# EAGLE board schematics (EAGLE 9.6.2), part 1 of 2
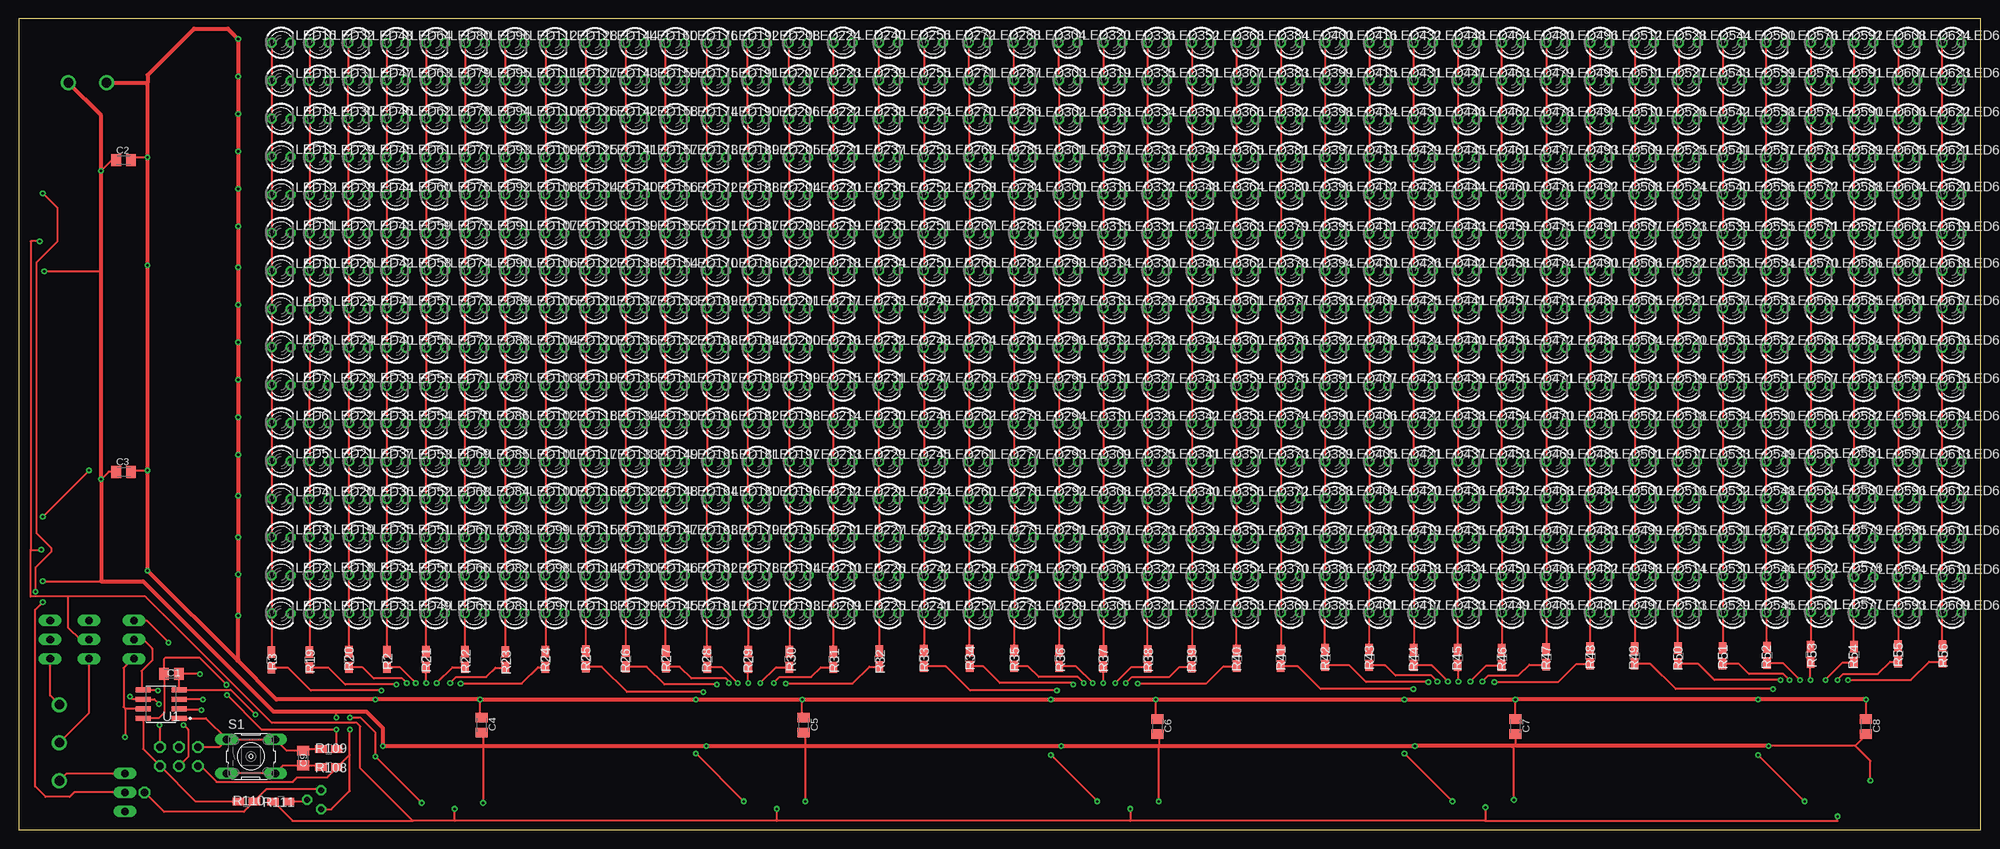
[diagram p2: board, top side]
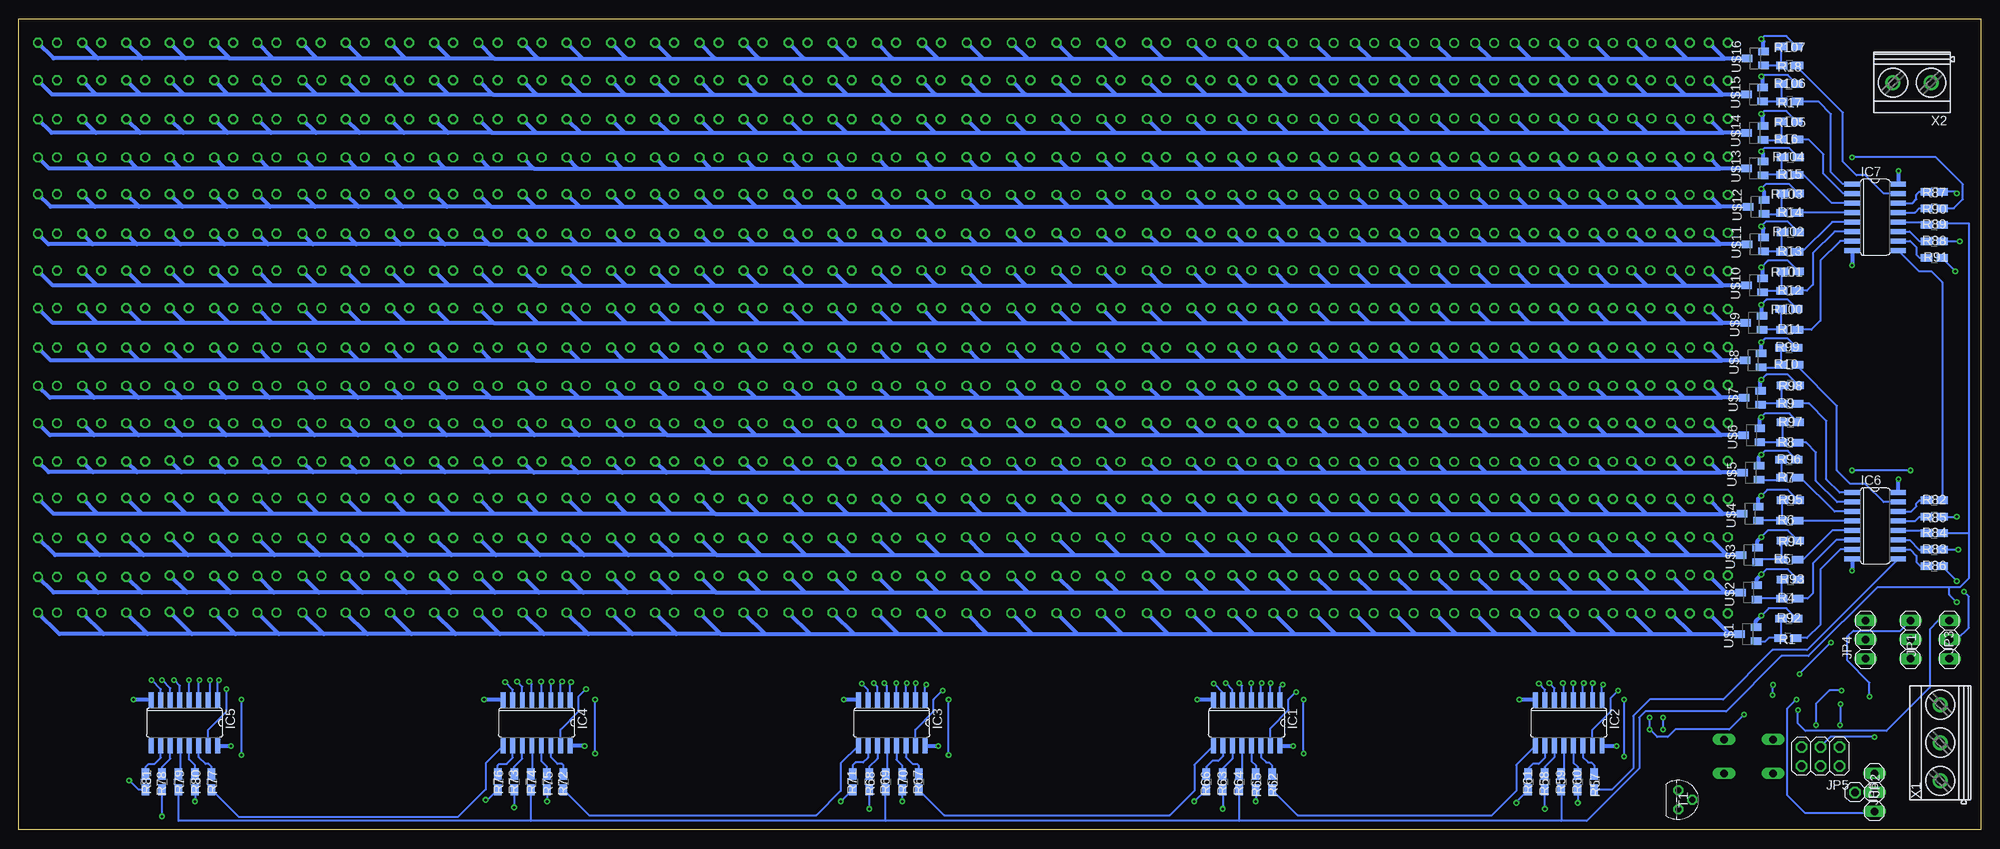
[diagram p3: board, bottom side, seen from below]

Size 261.94 x 108.32 mm. Coordinates in mm from the lower left corner, seen from the top.
Outline: 0,0 261.94,0 261.94,108.32 0,108.32 0,0
Copper layers (1*16): Top 0.035mm / dielectric 1.5mm / Bottom 0.035mm
Design rules "default": minimum track width 6mil, minimum drill 0.35mm, track to track 6mil, track to pad 6mil, pad to pad 6mil, via to via 6mil, smd to smd 6mil, copper to edge 40mil, drill to drill 6mil, minimum pad ring 10mil, minimum via ring 8mil, stop-mask expansion 4mil, vias tented up to drill 0mil, thermal gap 10mil

## Footprints (pad centres in the part's own frame; a part is rotated, then mirrored left to right if it is on the bottom)
C0805K = smd 1.3 x 1.6: 1 -1,0; 2 1,0
SO16 = smd 0.66 x 2.032: 1 -4.445,-3.073; 2 -3.175,-3.073; 3 -1.905,-3.073; 4 -0.635,-3.073; 5 0.635,-3.073; 6 1.905,-3.073; 7 3.175,-3.073; 8 4.445,-3.073; 9 4.445,3.073; 10 3.175,3.073; 11 1.905,3.073; 12 0.635,3.073; 13 -0.635,3.073; 14 -1.905,3.073; 15 -3.175,3.073; 16 -4.445,3.073
1X03 = drill 1.016 long: 1 -2.54,0; 2 0,0; 3 2.54,0
2X03 = drill 1.016 octagon: 1 -2.54,-1.27; 2 -2.54,1.27; 3 0,-1.27; 4 0,1.27; 5 2.54,-1.27; 6 2.54,1.27
1X01 = drill 1.016 octagon: 1 0,0
LED3MM = drill 0.813 octagon: A -1.27,0; K 1.27,0
R0805W = smd 1.5 x 1: 1 -1.052,0; 2 1.052,0
B3F-10XX = drill 1.016 long: 1 -3.251,2.261; 2 3.251,2.261; 3 -3.251,-2.261; 4 3.251,-2.261
TO92 = drill 0.813 octagon: 1 1.27,0; 2 0,1.905; 3 -1.27,0
SOIC-8 = smd 2 x 0.66: 1 -2.405,1.905; 2 -2.405,0.635; 3 -2.405,-0.635; 4 -2.405,-1.905; 5 2.405,-1.905; 6 2.405,-0.635; 7 2.405,0.635; 8 2.405,1.905
SOT23 = smd 1 x 1.4: 1 -0.95,-1.1; 2 0.95,-1.1; 3 0,1.1
MKDSN1,5/3-5,08 = drill 1.3 pad 2: 1 -7.641,0.025; 2 -2.561,0.025; 3 2.519,0.025
MKDSN1,5/2-5,08 = drill 1.3 pad 2: 1 -2.561,0.025; 2 2.519,0.025

## Placement (x,y rotation side)
C1  100n  [C0805K]  20.4,20.8 0 top
C2  100n  [C0805K]  14,89.4 0 top
C3  100n  [C0805K]  14,47.8 0 top
C4  100n  [C0805K]  61.8,14 270 top
C5  100n  [C0805K]  104.8,14 270 top
C6  100n  [C0805K]  152,13.8 270 top
C7  100n  [C0805K]  199.8,13.8 270 top
C8  100n  [C0805K]  246.6,13.8 270 top
C9  100n  [C0805K]  38,9.6 270 top
IC1  74HC595D  [SO16]  98,14.3 180 bottom
IC2  74HC595D  [SO16]  55,14.3 180 bottom
IC3  74HC595D  [SO16]  145.4,14.3 180 bottom
IC4  74HC595D  [SO16]  192.8,14.3 180 bottom
IC5  74HC595D  [SO16]  239.8,14.3 180 bottom
IC6  74HC595D  [SO16]  14.1,40.6 270 bottom
IC7  74HC595D  [SO16]  14.1,81.8 270 bottom
JP1  [1X03]  9.4,25.4 90 bottom
JP2  [1X03]  14.2,5 270 bottom
JP3  [1X03]  4.2,25.4 90 bottom
JP4  [1X03]  15.4,25.4 90 bottom
JP5  [2X03]  21.4,9.8 180 bottom
JP6  [1X01]  16.8,5 270 bottom
LED1  [LED3MM]  35.04,28.92 0 top
LED2  [LED3MM]  35.04,34 0 top
LED3  [LED3MM]  35.04,39.08 0 top
LED4  [LED3MM]  35.04,44.16 0 top
LED5  [LED3MM]  35.04,49.24 0 top
LED6  [LED3MM]  35.04,54.32 0 top
LED7  [LED3MM]  35.04,59.4 0 top
LED8  [LED3MM]  35.04,64.48 0 top
LED9  [LED3MM]  35.04,69.56 0 top
LED10  [LED3MM]  35.04,74.64 0 top
LED11  [LED3MM]  35.04,79.72 0 top
LED12  [LED3MM]  35.04,84.8 0 top
LED13  [LED3MM]  35.04,89.88 0 top
LED14  [LED3MM]  35.04,94.96 0 top
LED15  [LED3MM]  35.04,100.04 0 top
LED16  [LED3MM]  35.04,105.12 0 top
LED17  [LED3MM]  40.1,28.92 0 top
LED18  [LED3MM]  40.08,34.04 0 top
LED19  [LED3MM]  40.1,39.12 0 top
LED20  [LED3MM]  40.08,44.18 0 top
LED21  [LED3MM]  40.1,49.26 0 top
LED22  [LED3MM]  40.08,54.32 0 top
LED23  [LED3MM]  40.04,59.34 0 top
LED24  [LED3MM]  40.08,64.42 0 top
LED25  [LED3MM]  40.1,69.6 0 top
LED26  [LED3MM]  40.08,74.66 0 top
LED27  [LED3MM]  40.1,79.68 0 top
LED28  [LED3MM]  40.14,84.8 0 top
LED29  [LED3MM]  40.1,89.82 0 top
LED30  [LED3MM]  40.08,94.94 0 top
LED31  [LED3MM]  40.08,100.06 0 top
LED32  [LED3MM]  40.1,105.12 0 top
LED33  [LED3MM]  45.36,28.94 0 top
LED34  [LED3MM]  45.36,34.04 0 top
LED35  [LED3MM]  45.36,39.14 0 top
LED36  [LED3MM]  45.36,44.18 0 top
LED37  [LED3MM]  45.36,49.22 0 top
LED38  [LED3MM]  45.36,54.32 0 top
LED39  [LED3MM]  45.36,59.36 0 top
LED40  [LED3MM]  45.36,64.4 0 top
LED41  [LED3MM]  45.36,69.68 0 top
LED42  [LED3MM]  45.36,74.72 0 top
LED43  [LED3MM]  45.3,79.7 0 top
LED44  [LED3MM]  45.3,84.8 0 top
LED45  [LED3MM]  45.3,89.84 0 top
LED46  [LED3MM]  45.24,95 0 top
LED47  [LED3MM]  45.3,100.1 0 top
LED48  [LED3MM]  45.24,105.08 0 top
LED49  [LED3MM]  50.4,28.94 0 top
LED50  [LED3MM]  50.4,33.98 0 top
LED51  [LED3MM]  50.4,39.08 0 top
LED52  [LED3MM]  50.4,44.18 0 top
LED53  [LED3MM]  50.4,49.16 0 top
LED54  [LED3MM]  50.4,54.32 0 top
LED55  [LED3MM]  50.4,59.3 0 top
LED56  [LED3MM]  50.4,64.4 0 top
LED57  [LED3MM]  50.4,69.68 0 top
LED58  [LED3MM]  50.4,74.72 0 top
LED59  [LED3MM]  50.4,79.7 0 top
LED60  [LED3MM]  50.4,84.86 0 top
LED61  [LED3MM]  50.4,89.84 0 top
LED62  [LED3MM]  50.4,95 0 top
LED63  [LED3MM]  50.4,100.1 0 top
LED64  [LED3MM]  50.4,105.08 0 top
LED65  [LED3MM]  55.62,28.94 0 top
LED66  [LED3MM]  55.62,33.98 0 top
LED67  [LED3MM]  55.62,39.08 0 top
LED68  [LED3MM]  55.62,44.18 0 top
LED69  [LED3MM]  55.62,49.22 0 top
LED70  [LED3MM]  55.62,54.32 0 top
LED71  [LED3MM]  55.62,59.3 0 top
LED72  [LED3MM]  55.68,64.4 0 top
LED73  [LED3MM]  55.68,69.68 0 top
LED74  [LED3MM]  55.68,74.72 0 top
LED75  [LED3MM]  55.68,79.7 0 top
LED76  [LED3MM]  55.68,84.86 0 top
LED77  [LED3MM]  55.68,89.84 0 top
LED78  [LED3MM]  55.68,95 0 top
LED79  [LED3MM]  55.68,100.1 0 top
LED80  [LED3MM]  55.68,105.08 0 top
LED81  [LED3MM]  60.84,28.94 0 top
LED82  [LED3MM]  60.84,33.98 0 top
LED83  [LED3MM]  60.84,39.08 0 top
LED84  [LED3MM]  60.84,44.24 0 top
LED85  [LED3MM]  60.84,49.16 0 top
LED86  [LED3MM]  60.84,54.32 0 top
LED87  [LED3MM]  60.84,59.36 0 top
LED88  [LED3MM]  60.9,64.4 0 top
LED89  [LED3MM]  60.96,69.68 0 top
LED90  [LED3MM]  60.96,74.72 0 top
LED91  [LED3MM]  60.96,79.7 0 top
LED92  [LED3MM]  60.96,84.86 0 top
LED93  [LED3MM]  60.96,89.84 0 top
LED94  [LED3MM]  60.96,95 0 top
LED95  [LED3MM]  60.96,100.1 0 top
LED96  [LED3MM]  60.96,105.08 0 top
LED97  [LED3MM]  66.24,28.94 0 top
LED98  [LED3MM]  66.24,33.98 0 top
LED99  [LED3MM]  66.24,39.08 0 top
LED100  [LED3MM]  66.24,44.24 0 top
LED101  [LED3MM]  66.24,49.16 0 top
LED102  [LED3MM]  66.24,54.32 0 top
LED103  [LED3MM]  66.24,59.36 0 top
LED104  [LED3MM]  66.24,64.4 0 top
LED105  [LED3MM]  66.24,69.68 0 top
LED106  [LED3MM]  66.24,74.72 0 top
LED107  [LED3MM]  66.24,79.7 0 top
LED108  [LED3MM]  66.24,84.86 0 top
LED109  [LED3MM]  66.24,89.84 0 top
LED110  [LED3MM]  66.24,95 0 top
LED111  [LED3MM]  66.24,100.1 0 top
LED112  [LED3MM]  66.24,105.08 0 top
LED113  [LED3MM]  71.58,28.94 0 top
LED114  [LED3MM]  71.58,33.98 0 top
LED115  [LED3MM]  71.58,39.08 0 top
LED116  [LED3MM]  71.58,44.24 0 top
LED117  [LED3MM]  71.58,49.16 0 top
LED118  [LED3MM]  71.58,54.32 0 top
LED119  [LED3MM]  71.58,59.36 0 top
LED120  [LED3MM]  71.58,64.4 0 top
LED121  [LED3MM]  71.58,69.68 0 top
LED122  [LED3MM]  71.58,74.72 0 top
LED123  [LED3MM]  71.58,79.7 0 top
LED124  [LED3MM]  71.58,84.86 0 top
LED125  [LED3MM]  71.58,89.84 0 top
LED126  [LED3MM]  71.58,95 0 top
LED127  [LED3MM]  71.58,100.1 0 top
LED128  [LED3MM]  71.58,105.08 0 top
LED129  [LED3MM]  76.98,28.94 0 top
LED130  [LED3MM]  76.98,33.98 0 top
LED131  [LED3MM]  76.98,39.08 0 top
LED132  [LED3MM]  76.98,44.24 0 top
LED133  [LED3MM]  76.98,49.16 0 top
LED134  [LED3MM]  76.98,54.32 0 top
LED135  [LED3MM]  76.92,59.36 0 top
LED136  [LED3MM]  76.92,64.4 0 top
LED137  [LED3MM]  76.92,69.68 0 top
LED138  [LED3MM]  76.92,74.72 0 top
LED139  [LED3MM]  76.92,79.7 0 top
LED140  [LED3MM]  76.92,84.86 0 top
LED141  [LED3MM]  76.92,89.84 0 top
LED142  [LED3MM]  76.92,95 0 top
LED143  [LED3MM]  76.92,100.1 0 top
LED144  [LED3MM]  76.92,105.08 0 top
LED145  [LED3MM]  82.32,28.94 0 top
LED146  [LED3MM]  82.32,33.98 0 top
LED147  [LED3MM]  82.32,39.08 0 top
LED148  [LED3MM]  82.32,44.24 0 top
LED149  [LED3MM]  82.32,49.16 0 top
LED150  [LED3MM]  82.32,54.32 0 top
LED151  [LED3MM]  82.32,59.36 0 top
LED152  [LED3MM]  82.32,64.4 0 top
LED153  [LED3MM]  82.32,69.68 0 top
LED154  [LED3MM]  82.32,74.72 0 top
LED155  [LED3MM]  82.32,79.7 0 top
LED156  [LED3MM]  82.32,84.86 0 top
LED157  [LED3MM]  82.32,89.84 0 top
LED158  [LED3MM]  82.32,95 0 top
LED159  [LED3MM]  82.32,100.1 0 top
LED160  [LED3MM]  82.26,105.08 0 top
LED161  [LED3MM]  87.66,28.94 0 top
LED162  [LED3MM]  87.66,33.98 0 top
LED163  [LED3MM]  87.66,39.08 0 top
LED164  [LED3MM]  87.66,44.24 0 top
LED165  [LED3MM]  87.66,49.16 0 top
LED166  [LED3MM]  87.66,54.32 0 top
LED167  [LED3MM]  87.66,59.36 0 top
LED168  [LED3MM]  87.66,64.4 0 top
LED169  [LED3MM]  87.66,69.68 0 top
LED170  [LED3MM]  87.66,74.72 0 top
LED171  [LED3MM]  87.66,79.7 0 top
LED172  [LED3MM]  87.66,84.8 0 top
LED173  [LED3MM]  87.66,89.84 0 top
LED174  [LED3MM]  87.66,94.94 0 top
LED175  [LED3MM]  87.66,100.1 0 top
LED176  [LED3MM]  87.66,105.08 0 top
LED177  [LED3MM]  93.18,28.94 0 top
LED178  [LED3MM]  93.18,33.98 0 top
LED179  [LED3MM]  93.18,39.08 0 top
LED180  [LED3MM]  93.24,44.24 0 top
LED181  [LED3MM]  93.24,49.16 0 top
LED182  [LED3MM]  93.18,54.32 0 top
LED183  [LED3MM]  93.18,59.36 0 top
LED184  [LED3MM]  93.18,64.4 0 top
LED185  [LED3MM]  93.18,69.68 0 top
LED186  [LED3MM]  93.18,74.72 0 top
LED187  [LED3MM]  93.18,79.7 0 top
LED188  [LED3MM]  93.18,84.8 0 top
LED189  [LED3MM]  93.18,89.84 0 top
LED190  [LED3MM]  93.18,94.94 0 top
LED191  [LED3MM]  93.18,100.1 0 top
LED192  [LED3MM]  93.18,105.08 0 top
LED193  [LED3MM]  98.64,28.94 0 top
LED194  [LED3MM]  98.64,33.98 0 top
LED195  [LED3MM]  98.64,39.08 0 top
LED196  [LED3MM]  98.64,44.24 0 top
LED197  [LED3MM]  98.64,49.16 0 top
LED198  [LED3MM]  98.64,54.32 0 top
LED199  [LED3MM]  98.64,59.36 0 top
LED200  [LED3MM]  98.64,64.4 0 top
LED201  [LED3MM]  98.64,69.68 0 top
LED202  [LED3MM]  98.64,74.72 0 top
LED203  [LED3MM]  98.64,79.7 0 top
LED204  [LED3MM]  98.64,84.8 0 top
LED205  [LED3MM]  98.64,89.84 0 top
LED206  [LED3MM]  98.58,94.94 0 top
LED207  [LED3MM]  98.58,100.1 0 top
LED208  [LED3MM]  98.64,105.08 0 top
LED209  [LED3MM]  104.16,28.94 0 top
LED210  [LED3MM]  104.16,33.98 0 top
LED211  [LED3MM]  104.16,39.08 0 top
LED212  [LED3MM]  104.16,44.24 0 top
LED213  [LED3MM]  104.16,49.16 0 top
LED214  [LED3MM]  104.1,54.32 0 top
LED215  [LED3MM]  104.1,59.36 0 top
LED216  [LED3MM]  104.1,64.4 0 top
LED217  [LED3MM]  104.1,69.68 0 top
LED218  [LED3MM]  104.1,74.72 0 top
LED219  [LED3MM]  104.1,79.7 0 top
LED220  [LED3MM]  104.1,84.8 0 top
LED221  [LED3MM]  104.1,89.84 0 top
LED222  [LED3MM]  104.1,94.94 0 top
LED223  [LED3MM]  104.1,100.1 0 top
LED224  [LED3MM]  104.04,105.08 0 top
LED225  [LED3MM]  110.04,28.94 0 top
LED226  [LED3MM]  110.04,33.92 0 top
LED227  [LED3MM]  110.04,39.08 0 top
LED228  [LED3MM]  110.04,44.18 0 top
LED229  [LED3MM]  110.04,49.16 0 top
LED230  [LED3MM]  110.04,54.32 0 top
LED231  [LED3MM]  110.04,59.36 0 top
LED232  [LED3MM]  110.04,64.4 0 top
LED233  [LED3MM]  110.04,69.68 0 top
LED234  [LED3MM]  110.04,74.72 0 top
LED235  [LED3MM]  110.04,79.7 0 top
LED236  [LED3MM]  110.04,84.8 0 top
LED237  [LED3MM]  110.04,89.84 0 top
LED238  [LED3MM]  110.04,94.94 0 top
LED239  [LED3MM]  110.04,100.1 0 top
LED240  [LED3MM]  110.04,105.14 0 top
LED241  [LED3MM]  116.16,28.94 0 top
LED242  [LED3MM]  116.16,33.92 0 top
LED243  [LED3MM]  116.16,39.08 0 top
LED244  [LED3MM]  116.1,44.18 0 top
LED245  [LED3MM]  116.1,49.16 0 top
LED246  [LED3MM]  116.1,54.32 0 top
LED247  [LED3MM]  116.1,59.36 0 top
LED248  [LED3MM]  116.1,64.4 0 top
LED249  [LED3MM]  116.1,69.68 0 top
LED250  [LED3MM]  116.1,74.72 0 top
LED251  [LED3MM]  116.1,79.7 0 top
LED252  [LED3MM]  116.1,84.8 0 top
LED253  [LED3MM]  116.1,89.84 0 top
LED254  [LED3MM]  116.1,94.94 0 top
LED255  [LED3MM]  116.1,100.1 0 top
LED256  [LED3MM]  116.1,105.14 0 top
LED257  [LED3MM]  122.1,28.94 0 top
LED258  [LED3MM]  122.1,33.92 0 top
LED259  [LED3MM]  122.1,39.08 0 top
LED260  [LED3MM]  122.1,44.18 0 top
LED261  [LED3MM]  122.1,49.16 0 top
LED262  [LED3MM]  122.1,54.32 0 top
LED263  [LED3MM]  122.1,59.36 0 top
LED264  [LED3MM]  122.1,64.4 0 top
LED265  [LED3MM]  122.1,69.68 0 top
LED266  [LED3MM]  122.1,74.72 0 top
LED267  [LED3MM]  122.1,79.7 0 top
LED268  [LED3MM]  122.1,84.8 0 top
LED269  [LED3MM]  122.1,89.84 0 top
LED270  [LED3MM]  122.1,94.94 0 top
LED271  [LED3MM]  122.1,100.1 0 top
LED272  [LED3MM]  122.1,105.14 0 top
LED273  [LED3MM]  128.16,28.94 0 top
LED274  [LED3MM]  128.16,33.92 0 top
LED275  [LED3MM]  128.16,39.08 0 top
LED276  [LED3MM]  128.16,44.18 0 top
LED277  [LED3MM]  128.16,49.16 0 top
LED278  [LED3MM]  128.16,54.32 0 top
LED279  [LED3MM]  128.16,59.36 0 top
LED280  [LED3MM]  128.16,64.4 0 top
LED281  [LED3MM]  128.16,69.68 0 top
LED282  [LED3MM]  128.22,74.72 0 top
LED283  [LED3MM]  128.22,79.7 0 top
LED284  [LED3MM]  128.22,84.8 0 top
LED285  [LED3MM]  128.22,89.84 0 top
LED286  [LED3MM]  128.16,94.94 0 top
LED287  [LED3MM]  128.16,100.1 0 top
LED288  [LED3MM]  128.1,105.14 0 top
LED289  [LED3MM]  134.16,28.94 0 top
LED290  [LED3MM]  134.22,33.92 0 top
LED291  [LED3MM]  134.22,39.08 0 top
LED292  [LED3MM]  134.22,44.24 0 top
LED293  [LED3MM]  134.16,49.16 0 top
LED294  [LED3MM]  134.16,54.26 0 top
LED295  [LED3MM]  134.16,59.3 0 top
LED296  [LED3MM]  134.16,64.4 0 top
LED297  [LED3MM]  134.16,69.68 0 top
LED298  [LED3MM]  134.16,74.72 0 top
LED299  [LED3MM]  134.22,79.64 0 top
LED300  [LED3MM]  134.16,84.86 0 top
LED301  [LED3MM]  134.16,89.84 0 top
LED302  [LED3MM]  134.16,94.88 0 top
LED303  [LED3MM]  134.16,100.1 0 top
LED304  [LED3MM]  134.1,105.14 0 top
LED305  [LED3MM]  140.16,28.94 0 top
LED306  [LED3MM]  140.16,33.92 0 top
LED307  [LED3MM]  140.16,39.02 0 top
LED308  [LED3MM]  140.16,44.24 0 top
LED309  [LED3MM]  140.16,49.16 0 top
LED310  [LED3MM]  140.1,54.26 0 top
LED311  [LED3MM]  140.16,59.3 0 top
LED312  [LED3MM]  140.1,64.4 0 top
LED313  [LED3MM]  140.1,69.68 0 top
LED314  [LED3MM]  140.16,74.72 0 top
LED315  [LED3MM]  140.16,79.64 0 top
LED316  [LED3MM]  140.16,84.86 0 top
LED317  [LED3MM]  140.16,89.84 0 top
LED318  [LED3MM]  140.16,94.88 0 top
LED319  [LED3MM]  140.16,100.1 0 top
LED320  [LED3MM]  140.1,105.14 0 top
LED321  [LED3MM]  146.1,29 0 top
LED322  [LED3MM]  146.1,33.9 0 top
LED323  [LED3MM]  146.1,39 0 top
LED324  [LED3MM]  146.1,44.2 0 top
LED325  [LED3MM]  146.1,49.2 0 top
LED326  [LED3MM]  146.1,54.3 0 top
LED327  [LED3MM]  146.1,59.3 0 top
LED328  [LED3MM]  146.1,64.4 0 top
LED329  [LED3MM]  146.1,69.7 0 top
LED330  [LED3MM]  146.1,74.7 0 top
LED331  [LED3MM]  146.1,79.6 0 top
LED332  [LED3MM]  146.1,84.9 0 top
LED333  [LED3MM]  146.1,89.8 0 top
LED334  [LED3MM]  146.1,94.9 0 top
LED335  [LED3MM]  146.1,100.1 0 top
LED336  [LED3MM]  146.1,105.1 0 top
LED337  [LED3MM]  152,29 0 top
LED338  [LED3MM]  152,33.9 0 top
LED339  [LED3MM]  152,39 0 top
LED340  [LED3MM]  152,44.2 0 top
LED341  [LED3MM]  152,49.2 0 top
LED342  [LED3MM]  152,54.3 0 top
LED343  [LED3MM]  152,59.3 0 top
LED344  [LED3MM]  152,64.4 0 top
LED345  [LED3MM]  152,69.7 0 top
LED346  [LED3MM]  152,74.7 0 top
LED347  [LED3MM]  152,79.6 0 top
LED348  [LED3MM]  152,84.9 0 top
LED349  [LED3MM]  152,89.8 0 top
LED350  [LED3MM]  152,94.9 0 top
LED351  [LED3MM]  152,100.1 0 top
LED352  [LED3MM]  152,105.1 0 top
LED353  [LED3MM]  157.9,29 0 top
LED354  [LED3MM]  157.9,33.9 0 top
LED355  [LED3MM]  157.9,39 0 top
LED356  [LED3MM]  157.9,44.2 0 top
LED357  [LED3MM]  157.9,49.2 0 top
LED358  [LED3MM]  157.9,54.3 0 top
LED359  [LED3MM]  157.9,59.3 0 top
LED360  [LED3MM]  157.9,64.4 0 top
LED361  [LED3MM]  157.9,69.7 0 top
LED362  [LED3MM]  157.9,74.7 0 top
LED363  [LED3MM]  157.9,79.6 0 top
LED364  [LED3MM]  157.9,84.9 0 top
LED365  [LED3MM]  157.9,89.8 0 top
LED366  [LED3MM]  157.9,94.9 0 top
LED367  [LED3MM]  157.9,100.1 0 top
LED368  [LED3MM]  157.9,105.1 0 top
LED369  [LED3MM]  163.9,29 0 top
LED370  [LED3MM]  163.9,33.9 0 top
LED371  [LED3MM]  163.9,39 0 top
LED372  [LED3MM]  163.9,44.2 0 top
LED373  [LED3MM]  163.9,49.2 0 top
LED374  [LED3MM]  163.9,54.3 0 top
LED375  [LED3MM]  163.9,59.3 0 top
LED376  [LED3MM]  163.9,64.4 0 top
LED377  [LED3MM]  163.9,69.7 0 top
LED378  [LED3MM]  163.9,74.7 0 top
LED379  [LED3MM]  163.9,79.6 0 top
LED380  [LED3MM]  163.9,84.9 0 top
LED381  [LED3MM]  163.9,89.8 0 top
LED382  [LED3MM]  163.9,94.9 0 top
LED383  [LED3MM]  163.9,100.1 0 top
LED384  [LED3MM]  163.9,105.1 0 top
LED385  [LED3MM]  169.8,29 0 top
LED386  [LED3MM]  169.8,33.9 0 top
LED387  [LED3MM]  169.8,39 0 top
LED388  [LED3MM]  169.8,44.3 0 top
LED389  [LED3MM]  169.8,49.2 0 top
LED390  [LED3MM]  169.8,54.3 0 top
LED391  [LED3MM]  169.8,59.3 0 top
LED392  [LED3MM]  169.8,64.4 0 top
LED393  [LED3MM]  169.8,69.7 0 top
LED394  [LED3MM]  169.8,74.7 0 top
LED395  [LED3MM]  169.8,79.6 0 top
LED396  [LED3MM]  169.8,84.9 0 top
LED397  [LED3MM]  169.8,89.8 0 top
LED398  [LED3MM]  169.8,94.9 0 top
LED399  [LED3MM]  169.8,100.1 0 top
LED400  [LED3MM]  169.8,105.1 0 top
LED401  [LED3MM]  175.7,29 0 top
LED402  [LED3MM]  175.7,33.9 0 top
LED403  [LED3MM]  175.7,39 0 top
LED404  [LED3MM]  175.7,44.3 0 top
LED405  [LED3MM]  175.7,49.2 0 top
LED406  [LED3MM]  175.7,54.3 0 top
LED407  [LED3MM]  175.7,59.3 0 top
LED408  [LED3MM]  175.7,64.4 0 top
LED409  [LED3MM]  175.7,69.7 0 top
LED410  [LED3MM]  175.7,74.7 0 top
LED411  [LED3MM]  175.7,79.6 0 top
LED412  [LED3MM]  175.7,84.9 0 top
LED413  [LED3MM]  175.7,89.8 0 top
LED414  [LED3MM]  175.7,94.9 0 top
LED415  [LED3MM]  175.7,100.1 0 top
LED416  [LED3MM]  175.7,105.1 0 top
LED417  [LED3MM]  181.6,29 0 top
LED418  [LED3MM]  181.6,33.9 0 top
LED419  [LED3MM]  181.6,39 0 top
LED420  [LED3MM]  181.6,44.3 0 top
LED421  [LED3MM]  181.6,49.2 0 top
LED422  [LED3MM]  181.6,54.3 0 top
LED423  [LED3MM]  181.6,59.3 0 top
LED424  [LED3MM]  181.6,64.4 0 top
LED425  [LED3MM]  181.6,69.7 0 top
LED426  [LED3MM]  181.6,74.7 0 top
LED427  [LED3MM]  181.6,79.6 0 top
LED428  [LED3MM]  181.6,84.9 0 top
LED429  [LED3MM]  181.6,89.8 0 top
LED430  [LED3MM]  181.6,94.9 0 top
LED431  [LED3MM]  181.6,100.1 0 top
LED432  [LED3MM]  181.6,105.1 0 top
LED433  [LED3MM]  187.5,29 0 top
LED434  [LED3MM]  187.5,33.9 0 top
LED435  [LED3MM]  187.5,39 0 top
LED436  [LED3MM]  187.5,44.3 0 top
LED437  [LED3MM]  187.5,49.2 0 top
LED438  [LED3MM]  187.5,54.3 0 top
LED439  [LED3MM]  187.5,59.3 0 top
LED440  [LED3MM]  187.5,64.4 0 top
LED441  [LED3MM]  187.5,69.7 0 top
LED442  [LED3MM]  187.5,74.7 0 top
LED443  [LED3MM]  187.5,79.6 0 top
LED444  [LED3MM]  187.5,84.9 0 top
LED445  [LED3MM]  187.5,89.8 0 top
LED446  [LED3MM]  187.5,94.9 0 top
LED447  [LED3MM]  187.5,100.1 0 top
LED448  [LED3MM]  187.5,105.1 0 top
LED449  [LED3MM]  193.4,29 0 top
LED450  [LED3MM]  193.4,33.9 0 top
LED451  [LED3MM]  193.4,39 0 top
LED452  [LED3MM]  193.4,44.3 0 top
LED453  [LED3MM]  193.4,49.2 0 top
LED454  [LED3MM]  193.4,54.3 0 top
LED455  [LED3MM]  193.4,59.3 0 top
LED456  [LED3MM]  193.4,64.4 0 top
LED457  [LED3MM]  193.4,69.7 0 top
LED458  [LED3MM]  193.4,74.7 0 top
LED459  [LED3MM]  193.4,79.6 0 top
LED460  [LED3MM]  193.4,84.9 0 top
LED461  [LED3MM]  193.4,89.8 0 top
LED462  [LED3MM]  193.4,94.9 0 top
LED463  [LED3MM]  193.4,100.1 0 top
LED464  [LED3MM]  193.4,105.1 0 top
LED465  [LED3MM]  199.3,29 0 top
LED466  [LED3MM]  199.3,33.9 0 top
LED467  [LED3MM]  199.3,39 0 top
LED468  [LED3MM]  199.3,44.3 0 top
LED469  [LED3MM]  199.3,49.2 0 top
LED470  [LED3MM]  199.3,54.3 0 top
LED471  [LED3MM]  199.3,59.3 0 top
LED472  [LED3MM]  199.3,64.4 0 top
LED473  [LED3MM]  199.3,69.7 0 top
LED474  [LED3MM]  199.3,74.7 0 top
LED475  [LED3MM]  199.3,79.6 0 top
LED476  [LED3MM]  199.3,84.9 0 top
LED477  [LED3MM]  199.3,89.8 0 top
LED478  [LED3MM]  199.3,94.9 0 top
LED479  [LED3MM]  199.3,100.1 0 top
LED480  [LED3MM]  199.3,105.1 0 top
LED481  [LED3MM]  205.2,29 0 top
LED482  [LED3MM]  205.2,33.9 0 top
LED483  [LED3MM]  205.2,39 0 top
LED484  [LED3MM]  205.2,44.3 0 top
LED485  [LED3MM]  205.2,49.2 0 top
LED486  [LED3MM]  205.2,54.3 0 top
LED487  [LED3MM]  205.2,59.3 0 top
LED488  [LED3MM]  205.2,64.4 0 top
LED489  [LED3MM]  205.2,69.7 0 top
LED490  [LED3MM]  205.2,74.7 0 top
LED491  [LED3MM]  205.2,79.6 0 top
LED492  [LED3MM]  205.2,84.9 0 top
LED493  [LED3MM]  205.2,89.8 0 top
LED494  [LED3MM]  205.2,94.9 0 top
LED495  [LED3MM]  205.2,100.1 0 top
LED496  [LED3MM]  205.2,105.1 0 top
LED497  [LED3MM]  211.1,29 0 top
LED498  [LED3MM]  211.1,33.9 0 top
LED499  [LED3MM]  211.1,39 0 top
LED500  [LED3MM]  211.1,44.3 0 top
LED501  [LED3MM]  211.1,49.2 0 top
LED502  [LED3MM]  211.1,54.3 0 top
LED503  [LED3MM]  211.1,59.3 0 top
LED504  [LED3MM]  211.1,64.4 0 top
LED505  [LED3MM]  211.1,69.7 0 top
LED506  [LED3MM]  211.1,74.7 0 top
LED507  [LED3MM]  211.1,79.6 0 top
LED508  [LED3MM]  211.1,84.9 0 top
LED509  [LED3MM]  211.1,89.8 0 top
LED510  [LED3MM]  211.1,94.9 0 top
LED511  [LED3MM]  211.1,100.1 0 top
LED512  [LED3MM]  211.1,105.1 0 top
LED513  [LED3MM]  217,29 0 top
LED514  [LED3MM]  217,33.9 0 top
LED515  [LED3MM]  217,39 0 top
LED516  [LED3MM]  217,44.3 0 top
LED517  [LED3MM]  217,49.2 0 top
LED518  [LED3MM]  217,54.3 0 top
LED519  [LED3MM]  217,59.3 0 top
LED520  [LED3MM]  217,64.4 0 top
LED521  [LED3MM]  217,69.7 0 top
LED522  [LED3MM]  217,74.7 0 top
LED523  [LED3MM]  217,79.6 0 top
LED524  [LED3MM]  217,84.9 0 top
LED525  [LED3MM]  217,89.8 0 top
LED526  [LED3MM]  217,94.9 0 top
LED527  [LED3MM]  217,100.1 0 top
LED528  [LED3MM]  217,105.1 0 top
LED529  [LED3MM]  222.8,29 0 top
LED530  [LED3MM]  222.8,33.9 0 top
LED531  [LED3MM]  222.8,39 0 top
LED532  [LED3MM]  222.8,44.3 0 top
LED533  [LED3MM]  222.8,49.2 0 top
LED534  [LED3MM]  222.8,54.3 0 top
LED535  [LED3MM]  222.8,59.3 0 top
LED536  [LED3MM]  222.8,64.4 0 top
LED537  [LED3MM]  222.8,69.7 0 top
LED538  [LED3MM]  222.8,74.7 0 top
LED539  [LED3MM]  222.8,79.6 0 top
LED540  [LED3MM]  222.8,84.9 0 top
LED541  [LED3MM]  222.8,89.8 0 top
LED542  [LED3MM]  222.8,94.9 0 top
LED543  [LED3MM]  222.8,100.1 0 top
LED544  [LED3MM]  222.9,105.1 0 top
LED545  [LED3MM]  228.8,29 0 top
LED546  [LED3MM]  228.8,33.9 0 top
LED547  [LED3MM]  228.8,39 0 top
LED548  [LED3MM]  228.8,44.3 0 top
LED549  [LED3MM]  228.8,49.2 0 top
LED550  [LED3MM]  228.8,54.3 0 top
LED551  [LED3MM]  228.8,59.3 0 top
LED552  [LED3MM]  228.8,64.4 0 top
LED553  [LED3MM]  228.8,69.7 0 top
LED554  [LED3MM]  228.8,74.7 0 top
LED555  [LED3MM]  228.8,79.6 0 top
LED556  [LED3MM]  228.8,84.9 0 top
LED557  [LED3MM]  228.8,89.8 0 top
LED558  [LED3MM]  228.8,94.9 0 top
LED559  [LED3MM]  228.8,100.1 0 top
LED560  [LED3MM]  228.8,105.1 0 top
LED561  [LED3MM]  234.6,29 0 top
LED562  [LED3MM]  234.6,33.9 0 top
LED563  [LED3MM]  234.6,39 0 top
LED564  [LED3MM]  234.6,44.3 0 top
LED565  [LED3MM]  234.6,49.2 0 top
LED566  [LED3MM]  234.6,54.3 0 top
LED567  [LED3MM]  234.6,59.3 0 top
LED568  [LED3MM]  234.6,64.4 0 top
LED569  [LED3MM]  234.6,69.7 0 top
LED570  [LED3MM]  234.6,74.7 0 top
LED571  [LED3MM]  234.6,79.6 0 top
LED572  [LED3MM]  234.6,84.9 0 top
LED573  [LED3MM]  234.6,89.8 0 top
LED574  [LED3MM]  234.6,94.9 0 top
LED575  [LED3MM]  234.6,100.1 0 top
LED576  [LED3MM]  234.6,105.1 0 top
LED577  [LED3MM]  240.5,29.1 0 top
LED578  [LED3MM]  240.5,34 0 top
LED579  [LED3MM]  240.5,39.1 0 top
LED580  [LED3MM]  240.5,44.4 0 top
LED581  [LED3MM]  240.5,49.3 0 top
LED582  [LED3MM]  240.5,54.3 0 top
LED583  [LED3MM]  240.5,59.3 0 top
LED584  [LED3MM]  240.5,64.4 0 top
LED585  [LED3MM]  240.5,69.7 0 top
LED586  [LED3MM]  240.5,74.7 0 top
LED587  [LED3MM]  240.5,79.6 0 top
LED588  [LED3MM]  240.5,84.9 0 top
LED589  [LED3MM]  240.5,89.8 0 top
LED590  [LED3MM]  240.5,94.9 0 top
LED591  [LED3MM]  240.5,100.1 0 top
LED592  [LED3MM]  240.5,105.1 0 top
LED593  [LED3MM]  246.3,29 0 top
LED594  [LED3MM]  246.3,33.8 0 top
LED595  [LED3MM]  246.3,39 0 top
LED596  [LED3MM]  246.3,44.3 0 top
LED597  [LED3MM]  246.3,49.2 0 top
LED598  [LED3MM]  246.3,54.3 0 top
LED599  [LED3MM]  246.3,59.3 0 top
LED600  [LED3MM]  246.3,64.4 0 top
LED601  [LED3MM]  246.3,69.7 0 top
LED602  [LED3MM]  246.3,74.7 0 top
LED603  [LED3MM]  246.3,79.6 0 top
LED604  [LED3MM]  246.3,84.9 0 top
LED605  [LED3MM]  246.3,89.8 0 top
LED606  [LED3MM]  246.3,94.9 0 top
LED607  [LED3MM]  246.3,100.1 0 top
LED608  [LED3MM]  246.3,105.1 0 top
LED609  [LED3MM]  252.2,29 0 top
LED610  [LED3MM]  252.2,33.8 0 top
LED611  [LED3MM]  252.2,39 0 top
LED612  [LED3MM]  252.2,44.3 0 top
LED613  [LED3MM]  252.2,49.2 0 top
LED614  [LED3MM]  252.2,54.3 0 top
LED615  [LED3MM]  252.2,59.3 0 top
LED616  [LED3MM]  252.2,64.4 0 top
LED617  [LED3MM]  252.2,69.7 0 top
LED618  [LED3MM]  252.2,74.7 0 top
LED619  [LED3MM]  252.2,79.6 0 top
LED620  [LED3MM]  252.2,84.9 0 top
LED621  [LED3MM]  252.2,89.8 0 top
LED622  [LED3MM]  252.2,94.9 0 top
LED623  [LED3MM]  252.2,100.1 0 top
LED624  [LED3MM]  252.2,105.1 0 top
LED625  [LED3MM]  258.1,29 0 top
LED626  [LED3MM]  258.1,33.8 0 top
LED627  [LED3MM]  258.1,39 0 top
LED628  [LED3MM]  258.1,44.3 0 top
LED629  [LED3MM]  258.1,49.2 0 top
LED630  [LED3MM]  258.1,54.3 0 top
LED631  [LED3MM]  258.1,59.3 0 top
LED632  [LED3MM]  258.1,64.4 0 top
LED633  [LED3MM]  258.1,69.7 0 top
LED634  [LED3MM]  258.1,74.7 0 top
LED635  [LED3MM]  258.1,79.6 0 top
LED636  [LED3MM]  258.1,84.9 0 top
LED637  [LED3MM]  258.1,89.8 0 top
LED638  [LED3MM]  258.1,94.9 0 top
LED639  [LED3MM]  258.1,100.1 0 top
LED640  [LED3MM]  258.1,105.1 0 top
R1  1K  [R0805W]  25.75,25.6 180 bottom
R2  220  [R0805W]  49.14,22.76 270 top
R3  220  [R0805W]  33.72,22.67 270 top
R4  1K  [R0805W]  25.5,30.9 180 bottom
R5  1K  [R0805W]  25.5,36.1 180 bottom
R6  1K  [R0805W]  25.5,41.3 180 bottom
R7  1K  [R0805W]  25.5,47 180 bottom
R8  1K  [R0805W]  25.5,51.7 180 bottom
R9  1K  [R0805W]  25.5,56.9 180 bottom
R10  1K  [R0805W]  25.5,62.1 180 bottom
R11  1K  [R0805W]  25.5,66.8 180 bottom
R12  1K  [R0805W]  25.5,72 180 bottom
R13  1K  [R0805W]  25.5,77.2 180 bottom
R14  1K  [R0805W]  25.5,82.4 180 bottom
R15  1K  [R0805W]  25.5,87.47 180 bottom
R16  1K  [R0805W]  25.5,92.17 180 bottom
R17  1K  [R0805W]  25.5,97.25 180 bottom
R18  1K  [R0805W]  25.52,102.05 180 bottom
R19  220  [R0805W]  38.84,22.67 270 top
R20  220  [R0805W]  44.1,22.76 270 top
R21  220  [R0805W]  54.36,22.76 270 top
R22  220  [R0805W]  59.58,22.76 270 top
R23  220  [R0805W]  64.98,22.7 270 top
R24  220  [R0805W]  70.32,22.76 270 top
R25  220  [R0805W]  75.72,22.82 270 top
R26  220  [R0805W]  81.06,22.82 270 top
R27  220  [R0805W]  86.4,22.82 270 top
R28  220  [R0805W]  91.92,22.76 270 top
R29  220  [R0805W]  97.38,22.76 270 top
R30  220  [R0805W]  102.9,22.76 270 top
R31  220  [R0805W]  108.78,22.76 270 top
R32  220  [R0805W]  114.9,22.82 270 top
R33  220  [R0805W]  120.84,22.88 270 top
R34  220  [R0805W]  126.96,22.88 270 top
R35  220  [R0805W]  132.9,22.88 270 top
R36  220  [R0805W]  138.9,22.88 270 top
R37  220  [R0805W]  144.8,22.8 270 top
R38  220  [R0805W]  150.7,22.8 270 top
R39  220  [R0805W]  156.6,22.8 270 top
R40  220  [R0805W]  162.6,22.9 270 top
R41  220  [R0805W]  168.5,22.9 270 top
R42  220  [R0805W]  174.4,23 270 top
R43  220  [R0805W]  180.3,23 270 top
R44  220  [R0805W]  186.2,23 270 top
R45  220  [R0805W]  192.1,23 270 top
R46  220  [R0805W]  198,23 270 top
R47  220  [R0805W]  203.9,23.1 270 top
R48  220  [R0805W]  209.8,23.2 270 top
R49  220  [R0805W]  215.7,23.2 270 top
R50  220  [R0805W]  221.5,23.2 270 top
R51  220  [R0805W]  227.5,23.2 270 top
R52  220  [R0805W]  233.4,23.3 270 top
R53  220  [R0805W]  239.2,23.4 270 top
R54  220  [R0805W]  245,23.4 270 top
R55  220  [R0805W]  250.9,23.5 270 top
R56  220  [R0805W]  256.8,23.5 270 top
R57  1K  [R0805W]  51.6,6.4 270 bottom
R58  1K  [R0805W]  58.2,6.4 270 bottom
R59  1K  [R0805W]  56,6.4 270 bottom
R60  10K  [R0805W]  53.8,6.4 270 bottom
R61  10K  [R0805W]  60.4,6.4 270 bottom
R62  1K  [R0805W]  94.6,6.4 270 bottom
R63  1K  [R0805W]  101.2,6.4 270 bottom
R64  1K  [R0805W]  99,6.4 270 bottom
R65  10K  [R0805W]  96.8,6.4 270 bottom
R66  10K  [R0805W]  103.4,6.4 270 bottom
R67  1K  [R0805W]  141.8,6.4 270 bottom
R68  1K  [R0805W]  148.4,6.4 270 bottom
R69  1K  [R0805W]  146.2,6.4 270 bottom
R70  10K  [R0805W]  144,6.4 270 bottom
R71  10K  [R0805W]  150.6,6.4 270 bottom
R72  1K  [R0805W]  189.2,6.4 270 bottom
R73  1K  [R0805W]  195.8,6.4 270 bottom
R74  1K  [R0805W]  193.6,6.4 270 bottom
R75  10K  [R0805W]  191.4,6.4 270 bottom
R76  10K  [R0805W]  198,6.4 270 bottom
R77  1K  [R0805W]  236.2,6.4 270 bottom
R78  1K  [R0805W]  242.8,6.4 270 bottom
R79  1K  [R0805W]  240.6,6.4 270 bottom
R80  10K  [R0805W]  238.4,6.4 270 bottom
R81  10K  [R0805W]  245,6.4 270 bottom
R82  1K  [R0805W]  6.2,44 0 bottom
R83  1K  [R0805W]  6.2,37.4 0 bottom
R84  1K  [R0805W]  6.2,39.6 0 bottom
R85  10K  [R0805W]  6.2,41.8 0 bottom
R86  10K  [R0805W]  6.2,35.2 0 bottom
R87  1K  [R0805W]  6.2,85.2 0 bottom
R88  1K  [R0805W]  6.2,78.6 0 bottom
R89  1K  [R0805W]  6.2,80.8 0 bottom
R90  10K  [R0805W]  6.2,83 0 bottom
R91  10K  [R0805W]  6.2,76.4 0 bottom
R92  10K  [R0805W]  25.6,28.2 0 bottom
R93  10K  [R0805W]  25.4,33.4 0 bottom
R94  10K  [R0805W]  25.4,38.6 0 bottom
R95  10K  [R0805W]  25.4,44 0 bottom
R96  10K  [R0805W]  25.6,49.4 0 bottom
R97  10K  [R0805W]  25.4,54.4 0 bottom
R98  10K  [R0805W]  25.4,59.4 0 bottom
R99  10K  [R0805W]  25.6,64.4 0 bottom
R100  10K  [R0805W]  25.6,69.6 0 bottom
R101  10K  [R0805W]  25.4,74.6 0 bottom
R102  10K  [R0805W]  25.4,79.8 0 bottom
R103  10K  [R0805W]  25.4,85 0 bottom
R104  10K  [R0805W]  25.4,89.8 0 bottom
R105  10K  [R0805W]  25.6,94.6 0 bottom
R106  10K  [R0805W]  25.6,99.6 0 bottom
R107  10K  [R0805W]  25.6,104.6 0 bottom
R108  1K  [R0805W]  41.4,8.4 0 top
R109  10K  [R0805W]  41.4,10.8 0 top
R110  1K  [R0805W]  30.4,3.8 0 top
R111  1K  [R0805W]  35,3.8 180 top
S1  [B3F-10XX]  31,9.8 0 top
T1  BC547  [TO92]  40.4,4 270 bottom
U1  ATTINY85-20SU  [SOIC-8]  19,16.8 180 top
U$1  IRLML2030  [SOT23]  31.11,26.15 90 bottom
U$2  IRLML2030  [SOT23]  31,31.7 90 bottom
U$3  IRLML2030  [SOT23]  30.9,36.7 90 bottom
U$4  IRLML2030  [SOT23]  30.8,42.2 90 bottom
U$5  IRLML2030  [SOT23]  30.7,47.7 90 bottom
U$6  IRLML2030  [SOT23]  30.6,52.7 90 bottom
U$7  IRLML2030  [SOT23]  30.5,57.7 90 bottom
U$8  IRLML2030  [SOT23]  30.4,62.7 90 bottom
U$9  IRLML2030  [SOT23]  30.3,67.7 90 bottom
U$10  IRLML2030  [SOT23]  30.2,72.7 90 bottom
U$11  IRLML2030  [SOT23]  30.1,78.2 90 bottom
U$12  IRLML2030  [SOT23]  30,83.2 90 bottom
U$13  IRLML2030  [SOT23]  30.15,88.33 90 bottom
U$14  IRLML2030  [SOT23]  30.18,93.08 90 bottom
U$15  IRLML2030  [SOT23]  30.2,98.2 90 bottom
U$16  IRLML2030  [SOT23]  30.1,103 90 bottom
X1  MKDSN1,5/3-5,08  [MKDSN1,5/3-5,08]  5.4,14.2 90 bottom
X2  MKDSN1,5/2-5,08  [MKDSN1,5/2-5,08]  9.2,99.8 180 bottom

## Tracks (layer width: path | path; a pad name or v marks a point on that pad's centre or on a via)
+5V  (via drill 0.35)
  Top 0.254: v3.4,74.6 11,74.6 | v3.2,33.2 11,33.2 | v62,3.6 62,11.2 62,12.8 C4.2 | v105,3.8 105,11.2 105,12.8 C5.2 | v152.2,3.8 152.2,11.2 152.2,12.6 C6.2 | v199.6,4 199.6,11 199.4,11.2 | v247.2,6.6 247.2,9.2 245.2,11.2 | 245.2,11.2 v233.6,11.2 | C8.2 246.6,12.6 245.2,11.2 | C7.2 199.8,11.4 199.6,11.2 | C3.1 12,47.8 v11,46.8 | C2.1 12.4,89.4 v11,88 | R109.2 42.45,13.35 v42.4,13.4 32.4,13.4 v27.8,18 | v42.4,15 42.4,15.8 | v27.75,19.36 24.12,23 19.6,23 19.4,22.8 C1.1 19.4,15.6 18.7,14.89 U1.8 16.59,10.79 JP5.2 23.59,3.8 R110.1
  Top 0.508: v233.6,11.2 199.6,11.2 199.4,11.2 v186.4,11.2 152.2,11.2 v139.2,11.2 105,11.2 v91.8,11.2 62,11.2 v48.6,11.2 48.6,13.6 46.4,15.8 42.4,15.8 34,15.8 16.6,33.2 11,33.2 v11,46.8 11,74.6 v11,88 11,95.41 X2.1
  Bottom 0.254: R91.2 5.15,76.35 v3.4,74.6 | R86.2 3.2,33.25 v3.2,33.2 | R61.2 62,3.75 v62,3.6 | v105,3.8 104.95,3.8 R66.2 | R71.2 152.15,3.8 v152.2,3.8 | R76.2 199.35,4 v199.6,4 | R81.2 245.95,5.35 v247.2,6.6 | v42.4,13.4 v42.4,15 | v27.75,19.36 27.8,19.32 v27.8,18
  Bottom 0.508: IC5.16 235.33,11.2 v233.6,11.2 | v186.4,11.2 186.43,11.23 IC4.16 | IC3.16 139.23,11.23 v139.2,11.2 | IC1.16 93.53,11.2 v91.8,11.2 | IC2.16 50.53,11.2 v48.6,11.2 | IC6.16 11.03,46.77 v11,46.8 | v11,88 11,86.27 IC7.16
CLOCK  (via drill 0.35)
  Top 0.254: v2.8,78.6 1.6,78.6 1.6,37.4 | 1.6,37.4 v3,37.4 | v101.2,2.8 101.2,1.2 | 101.2,1.2 58.2,1.2 | 58.2,1.2 v58.2,2.8 | v148.4,2.8 148.4,1.2 | 148.4,1.2 101.2,1.2 | v195.8,3 195.8,1.2 | 195.8,1.2 148.4,1.2 | 195.8,1.2 242.8,1.2 v242.8,1.8 | 58.2,1.2 52.6,1.2 | 52.6,1.2 45.6,8.2 45.6,13.8 45.13,14.27 33.78,14.27 16.9,31.14 6.6,31.14 | 6.6,31.14 1.6,31.14 1.6,37.4 | JP1.2 8.2,25.4 6.6,27 6.6,31.14 | R111.2 36.55,1.2 52.6,1.2
  Bottom 0.254: R88.2 v2.8,78.6 | v3,37.4 R83.2 | R63.2 v101.2,2.8 | v58.2,2.8 R58.2 | R68.2 v148.4,2.8 | R73.2 v195.8,3 | v242.8,1.8 R78.2
DATA  (via drill 0.35)
  Top 0.254: v2.26,31.8 2.26,35.06 4.4,37.2 4.4,37.6 2.4,39.6 2.4,75.8 5.2,78.6 5.2,83 v3.2,85
  Bottom 0.254: JP3.2 3.2,25.4 1.6,27 1.6,31.14 v2.26,31.8 | v3.2,85 3.4,85.2 R87.2
GND  (via drill 0.35)
  Top 0.254: v3.2,41.8 v9.4,48 | v53.8,3.6 v47.6,9.8 47.6,13 45.6,15 v44.2,15 | v96.8,3.8 v90.4,10.2 | v144,3.8 v137.8,10 | v191.4,3.8 v185,10.2 | v238.4,3.8 v232.2,10 | v246.6,17.4 C8.1 | C7.1 v199.8,17.4 | C6.1 151.8,15 v151.8,17.4 | C5.1 104.6,15.2 v104.6,17.4 | C4.1 61.6,15.2 v61.6,17.4 | C3.2 15.2,48 v17.2,48 | C2.2 15.4,89.8 v17.2,89.8 | R108.2 42.6,8.4 | 42.6,8.4 44.2,10 | 44.2,10 v44.2,13.4 | v31.6,15.4 28.3,18.7 U1.4 C1.2 v24.2,20.8 | JP4.3 17.06,27.94 v20,25 | JP5.6 24.27,8.53 26.4,6.4 36.6,6.4 37.2,7 41.2,7 42.6,8.4 | 44.2,10 44.2,5.2 41.73,2.73 T1.1
  Top 0.508: v246.6,17.4 v232.2,17.4 v199.8,17.4 v185,17.4 v151.8,17.4 v137.8,17.4 v104.6,17.4 v90.4,17.4 v61.6,17.4 v47.6,17.4 34.4,17.4 29.2,22.6 | 29.2,22.6 29.3,22.7 v29.3,28.6 v29.3,34.1 v29.3,39.1 v29.3,44.6 v29.3,50.1 v29.3,55.1 v29.3,60.1 v29.3,65.1 v29.3,70.1 v29.3,75.1 v29.3,80.6 v29.3,85.6 v29.3,90.6 v29.3,95.6 v29.3,100.6 v29.3,105.6 27.9,107 23.4,107 17.2,100.8 17.2,99.78 | 29.2,22.6 v17.2,34.6 v17.2,48 v17.2,75.4 v17.2,89.8 17.2,99.78 | X2.2 17.2,99.78
  Bottom 0.254: R107.2 25.95,106 28.9,106 v29.3,105.6 | R106.2 25.75,100.8 29.1,100.8 v29.3,100.6 | R105.2 25.95,96 28.9,96 v29.3,95.6 | R104.2 25.55,91 28.9,91 v29.3,90.6 | R103.2 25.55,86.2 28.7,86.2 v29.3,85.6 | R102.2 25.75,81.2 28.7,81.2 v29.3,80.6 | R101.2 25.75,76 28.4,76 v29.3,75.1 | R100.2 25.75,70.8 28.6,70.8 v29.3,70.1 | R99.2 25.75,65.6 28.8,65.6 v29.3,65.1 | R98.2 25.75,60.8 28.6,60.8 v29.3,60.1 | R97.2 25.55,55.6 28.8,55.6 v29.3,55.1 | R96.2 25.75,50.6 28.8,50.6 v29.3,50.1 | R95.2 25.75,45.4 28.5,45.4 v29.3,44.6 | R94.2 25.75,40 28.4,40 v29.3,39.1 | R93.2 25.75,34.8 28.6,34.8 v29.3,34.1 | R92.2 25.95,29.6 28.3,29.6 v29.3,28.6 | R90.2 3.6,83 2.4,84.2 2.4,86.2 6,89.8 v17.2,89.8 | R85.2 v3.2,41.8 | v9.4,48 v17.2,48 | R60.2 v53.8,3.6 | v47.6,9.8 v47.6,17.4 | R65.2 v96.8,3.8 | v90.4,10.2 v90.4,17.4 | R70.2 v144,3.8 | v137.8,10 v137.8,17.4 | R75.2 v191.4,3.8 | v185,10.2 v185,17.4 | R80.2 v238.4,3.8 | v232.2,10 v232.2,17.4 | v44.2,15 v44.2,13.4 43.2,12.4 41.8,12.4 40.8,13.4 33.6,13.4 v31.6,15.4 | v20,25 v24.2,20.8
  Bottom 0.508: U$16.2 29,105.3 v29.3,105.6 | U$15.2 29.1,100.4 v29.3,100.6 | U$14.2 29.07,95.38 v29.3,95.6 | U$13.2 29.05,90.35 v29.3,90.6 | U$12.2 28.9,85.2 v29.3,85.6 | U$11.2 29,80.3 v29.3,80.6 | U$10.2 29.1,74.9 v29.3,75.1 | U$9.2 29.2,70 v29.3,70.1 | U$8.2 v29.3,65.1 | U$7.2 29.4,60 v29.3,60.1 | U$6.2 29.5,54.9 v29.3,55.1 | U$5.2 29.6,49.8 v29.3,50.1 | U$4.2 29.7,44.2 v29.3,44.6 | U$3.2 29.8,38.6 v29.3,39.1 | U$2.2 29.9,33.5 v29.3,34.1 | U$1.2 30.01,27.89 v29.3,28.6 | IC5.8 246.57,17.37 v246.6,17.4 | v199.8,17.4 197.27,17.4 IC4.8 | IC3.8 151.77,17.37 v151.8,17.4 | IC1.8 104.57,17.37 v104.6,17.4 | IC2.8 61.57,17.37 v61.6,17.4 | IC7.8 17.17,75.43 v17.2,75.4 | IC6.8 17.17,34.63 v17.2,34.6
LATCH  (via drill 0.35)
  Top 0.254: JP2.2 7.4,5 6.8,4.4 3.6,4.4 2.2,5.8 2.2,29.4 v3.2,30.4
  Bottom 0.254: R59.2 56,1.2 | 56,1.2 99,1.2 | 99,1.2 R64.2 | 99,1.2 146.2,1.2 | 146.2,1.2 R69.2 | 146.2,1.2 193.6,1.2 | R74.2 193.6,1.2 | 193.6,1.2 240.6,1.2 R79.2 | R89.2 4.95,81 1.6,81 1.6,39.6 | 1.6,39.6 R84.2 | 1.6,39.6 1.6,33.6 2.8,32.4 4.2,32.4 | 4.2,32.4 13.8,32.4 23,23.2 26.6,23.2 34,15.8 44.8,15.8 45.6,15 45.6,8.2 52.6,1.2 56,1.2 | v3.2,30.4 4.2,31.4 4.2,32.4
MISO  (via drill 0.35)
  Top 0.254: v14.86,17.8 15.22,17.43 U1.6 18.11,17.43 v18.74,16.8 | v18.8,14 18.8,11.13 JP5.1
  Bottom 0.254: v14.86,17.8 14.86,19.66 17.8,22.6 17.8,25.8 17,26.6 10.74,26.6 JP1.3 | v18.74,16.8 18.74,14.06 v18.8,14
MOSI  (via drill 0.35)
  Top 0.254: JP4.2 16.6,25.4 17.8,24.2 17.8,22.6 16.4,21.2 16.4,18.9 U1.5 18.5,18.7 v18.6,18.6 | v22,14 22.6,13.4 22.6,9.73 JP5.4
  Bottom 0.254: v18.6,18.6 20.2,18.6 22,16.8 v22,14
N$1
  Top 0.254: LED16.A LED15.A LED14.A LED13.A LED12.A LED11.A LED10.A LED9.A LED8.A LED7.A LED6.A LED5.A LED4.A LED3.A LED2.A LED1.A 33.77,23.77 R3.1
N$2
  Bottom 0.508: U$2.3 34.01,31.7 | 34.01,31.7 LED2.K | LED18.K 39.01,31.7 | 39.01,31.7 34.01,31.7 | LED34.K 44.29,31.7 | 44.29,31.7 39.01,31.7 | LED50.K 49.39,31.7 | 49.39,31.7 44.29,31.7 | LED66.K 54.61,31.7 | 54.61,31.7 49.39,31.7 | LED82.K 59.83,31.7 | 59.83,31.7 54.61,31.7 | LED98.K 65.23,31.7 | 65.23,31.7 59.83,31.7 | LED114.K 70.57,31.7 | 70.57,31.7 65.23,31.7 | LED130.K 75.97,31.7 | 75.97,31.7 70.57,31.7 | LED146.K 81.31,31.7 | 81.31,31.7 75.97,31.7 | LED162.K 86.65,31.7 | 86.65,31.7 81.31,31.7 | LED178.K 92.17,31.7 | 92.17,31.7 86.65,31.7 | LED194.K 97.63,31.7 | 97.63,31.7 92.17,31.7 | LED210.K 103.15,31.7 | 103.15,31.7 97.63,31.7 | LED226.K 109.09,31.7 | 109.09,31.7 103.15,31.7 | LED242.K 115.21,31.7 | 115.21,31.7 109.09,31.7 | LED258.K 121.15,31.7 | 121.15,31.7 115.21,31.7 | LED274.K 127.21,31.7 | 127.21,31.7 121.15,31.7 | LED290.K 133.27,31.7 | 133.27,31.7 127.21,31.7 | LED306.K 139.21,31.7 | 139.21,31.7 133.27,31.7 | LED322.K 145.17,31.7 | 145.17,31.7 139.21,31.7 | LED338.K 151.07,31.7 | 151.07,31.7 145.17,31.7 | LED354.K 156.97,31.7 | 156.97,31.7 151.07,31.7 | LED370.K 162.97,31.7 | 162.97,31.7 156.97,31.7 | LED386.K 168.87,31.7 | 168.87,31.7 162.97,31.7 | 168.87,31.7 174.77,31.7 | 174.77,31.7 LED402.K | 174.77,31.7 180.67,31.7 | LED418.K 180.67,31.7 | 180.67,31.7 186.57,31.7 | LED434.K 186.57,31.7 | 186.57,31.7 192.47,31.7 | 192.47,31.7 LED450.K | 192.47,31.7 198.37,31.7 | LED466.K 198.37,31.7 | 198.37,31.7 204.27,31.7 | 204.27,31.7 LED482.K | 204.27,31.7 210.17,31.7 | 210.17,31.7 LED498.K | 210.17,31.7 216.07,31.7 | 216.07,31.7 LED514.K | 216.07,31.7 221.87,31.7 | LED530.K 221.87,31.7 | 221.87,31.7 227.87,31.7 | 227.87,31.7 LED546.K | 227.87,31.7 233.67,31.7 | 233.67,31.7 LED562.K | 233.67,31.7 239.47,31.7
  Bottom 0.508: 239.47,31.7 LED578.K | 239.47,31.7 245.47,31.7 | LED594.K 245.47,31.7 | 245.47,31.7 251.37,31.7 | 251.37,31.7 LED610.K | 251.37,31.7 257.27,31.7 LED626.K
N$3
  Bottom 0.254: U$2.1 29.75,30.9 R4.2 26.55,33.3 R93.1
N$4
  Bottom 0.508: U$3.3 33.93,36.7 | 33.93,36.7 LED3.K | LED19.K 38.95,36.7 | 38.95,36.7 33.93,36.7 | LED35.K 44.19,36.7 | 44.19,36.7 38.95,36.7 | LED51.K 49.29,36.7 | 49.29,36.7 44.19,36.7 | LED67.K 54.51,36.7 | 54.51,36.7 49.29,36.7 | LED83.K 59.73,36.7 | 59.73,36.7 54.51,36.7 | LED99.K 65.13,36.7 | 65.13,36.7 59.73,36.7 | LED115.K 70.47,36.7 | 70.47,36.7 65.13,36.7 | LED131.K 75.87,36.7 | 75.87,36.7 70.47,36.7 | LED147.K 81.21,36.7 | 81.21,36.7 75.87,36.7 | LED163.K 86.55,36.7 | 86.55,36.7 81.21,36.7 | LED179.K 92.07,36.7 | 92.07,36.7 86.55,36.7 | LED195.K 97.53,36.7 | 97.53,36.7 92.07,36.7 | LED211.K 103.05,36.7 | 103.05,36.7 97.53,36.7 | LED227.K 108.93,36.7 | 108.93,36.7 103.05,36.7 | LED243.K 115.05,36.7 | 115.05,36.7 108.93,36.7 | LED259.K 120.99,36.7 | 120.99,36.7 115.05,36.7 | LED275.K 127.05,36.7 | 127.05,36.7 120.99,36.7 | LED291.K 133.11,36.7 | 133.11,36.7 127.05,36.7 | LED307.K 139.11,36.7 | 139.11,36.7 133.11,36.7 | LED323.K 145.07,36.7 | 145.07,36.7 139.11,36.7 | LED339.K 150.97,36.7 | 150.97,36.7 145.07,36.7 | LED355.K 156.87,36.7 | 156.87,36.7 150.97,36.7 | LED371.K 162.87,36.7 | 162.87,36.7 156.87,36.7 | LED387.K 168.77,36.7 | 168.77,36.7 162.87,36.7 | 168.77,36.7 174.67,36.7 | LED403.K 174.67,36.7 | 174.67,36.7 180.57,36.7 | LED419.K 180.57,36.7 | 180.57,36.7 186.47,36.7 | 186.47,36.7 LED435.K | 186.47,36.7 192.37,36.7 | LED451.K 192.37,36.7 | 192.37,36.7 198.27,36.7 | 198.27,36.7 LED467.K | 198.27,36.7 204.17,36.7 | 204.17,36.7 LED483.K | 204.17,36.7 210.07,36.7 | LED499.K 210.07,36.7 | 210.07,36.7 215.97,36.7 | 215.97,36.7 LED515.K | 215.97,36.7 221.77,36.7 | LED531.K 221.77,36.7 | 221.77,36.7 227.77,36.7 | 227.77,36.7 LED547.K | 227.77,36.7 233.57,36.7 | LED563.K 233.57,36.7 | 233.57,36.7 239.37,36.7
  Bottom 0.508: 239.37,36.7 LED579.K | 239.37,36.7 245.27,36.7 | LED595.K 245.27,36.7 | 245.27,36.7 251.17,36.7 | 251.17,36.7 LED611.K | 251.17,36.7 257.07,36.7 LED627.K
N$5
  Bottom 0.254: U$3.1 29.45,36.1 R5.2 26.55,38.5 R94.1
N$6
  Bottom 0.508: U$4.3 34.35,42.2 | 34.35,42.2 LED4.K | LED20.K 39.37,42.2 | 39.37,42.2 34.35,42.2 | LED36.K 44.65,42.2 | 44.65,42.2 39.37,42.2 | LED52.K 49.69,42.2 | 49.69,42.2 44.65,42.2 | LED68.K 54.91,42.2 | 54.91,42.2 49.69,42.2 | LED84.K 60.07,42.2 | 60.07,42.2 54.91,42.2 | LED100.K 65.47,42.2 | 65.47,42.2 60.07,42.2 | LED116.K 70.81,42.2 | 70.81,42.2 65.47,42.2 | LED132.K 76.21,42.2 | 76.21,42.2 70.81,42.2 | LED148.K 81.55,42.2 | 81.55,42.2 76.21,42.2 | LED164.K 86.89,42.2 | 86.89,42.2 81.55,42.2 | LED180.K 92.47,42.2 | 92.47,42.2 86.89,42.2 | LED196.K 97.87,42.2 | 97.87,42.2 92.47,42.2 | LED212.K 103.39,42.2 | 103.39,42.2 97.87,42.2 | LED228.K 109.33,42.2 | 109.33,42.2 103.39,42.2 | LED244.K 115.39,42.2 | 115.39,42.2 109.33,42.2 | LED260.K 121.39,42.2 | 121.39,42.2 115.39,42.2 | LED276.K 127.45,42.2 | 127.45,42.2 121.39,42.2 | LED292.K 133.45,42.2 | 133.45,42.2 127.45,42.2 | LED308.K 139.39,42.2 | 139.39,42.2 133.45,42.2 | LED324.K 145.37,42.2 | 145.37,42.2 139.39,42.2 | LED340.K 151.27,42.2 | 151.27,42.2 145.37,42.2 | LED356.K 157.17,42.2 | 157.17,42.2 151.27,42.2 | LED372.K 163.17,42.2 | 163.17,42.2 157.17,42.2 | LED388.K 168.97,42.2 | 168.97,42.2 163.17,42.2 | 168.97,42.2 174.87,42.2 | 174.87,42.2 LED404.K | 174.87,42.2 180.77,42.2 | 180.77,42.2 LED420.K | 180.77,42.2 186.67,42.2 | 186.67,42.2 LED436.K | 186.67,42.2 192.57,42.2 | 192.57,42.2 LED452.K | 192.57,42.2 198.47,42.2 | LED468.K 198.47,42.2 | 198.47,42.2 204.37,42.2 | LED484.K 204.37,42.2 | 204.37,42.2 210.27,42.2 | 210.27,42.2 LED500.K | 210.27,42.2 216.17,42.2 | 216.17,42.2 LED516.K | 216.17,42.2 221.97,42.2 | 221.97,42.2 LED532.K | 221.97,42.2 227.97,42.2 | 227.97,42.2 LED548.K | 227.97,42.2 233.77,42.2 | 233.77,42.2 LED564.K | 233.77,42.2 239.57,42.2
  Bottom 0.508: 239.57,42.2 LED580.K | 239.57,42.2 245.47,42.2 | 245.47,42.2 LED596.K | 245.47,42.2 251.37,42.2 | 251.37,42.2 LED612.K | 251.37,42.2 257.27,42.2 LED628.K
N$7
  Bottom 0.254: U$4.1 29.65,41.3 R6.2 26.55,43.9 R95.1
N$8
  Bottom 0.508: U$5.3 34.77,47.7 | 34.77,47.7 LED5.K | LED21.K 39.81,47.7 | 39.81,47.7 34.77,47.7 | LED37.K 45.11,47.7 | 45.11,47.7 39.81,47.7 | LED53.K 50.21,47.7 | 50.21,47.7 45.11,47.7 | LED69.K 55.37,47.7 | 55.37,47.7 50.21,47.7 | LED85.K 60.65,47.7 | 60.65,47.7 55.37,47.7 | LED101.K 66.05,47.7 | 66.05,47.7 60.65,47.7 | LED117.K 71.39,47.7 | 71.39,47.7 66.05,47.7 | LED133.K 76.79,47.7 | 76.79,47.7 71.39,47.7 | LED149.K 82.13,47.7 | 82.13,47.7 76.79,47.7 | LED165.K 87.47,47.7 | 87.47,47.7 82.13,47.7 | LED181.K 93.05,47.7 | 93.05,47.7 87.47,47.7 | LED197.K 98.45,47.7 | 98.45,47.7 93.05,47.7 | LED213.K 103.97,47.7 | 103.97,47.7 98.45,47.7 | LED229.K 109.85,47.7 | 109.85,47.7 103.97,47.7 | LED245.K 115.91,47.7 | 115.91,47.7 109.85,47.7 | LED261.K 121.91,47.7 | 121.91,47.7 115.91,47.7 | LED277.K 127.97,47.7 | 127.97,47.7 121.91,47.7 | LED293.K 133.97,47.7 | 133.97,47.7 127.97,47.7 | LED309.K 139.97,47.7 | 139.97,47.7 133.97,47.7 | LED325.K 145.87,47.7 | 145.87,47.7 139.97,47.7 | LED341.K 151.77,47.7 | 151.77,47.7 145.87,47.7 | LED357.K 157.67,47.7 | 157.67,47.7 151.77,47.7 | LED373.K 163.67,47.7 | 163.67,47.7 157.67,47.7 | LED389.K 169.57,47.7 | 169.57,47.7 163.67,47.7 | 169.57,47.7 175.47,47.7 | 175.47,47.7 LED405.K | 175.47,47.7 181.37,47.7 | 181.37,47.7 LED421.K | 181.37,47.7 187.27,47.7 | 187.27,47.7 LED437.K | 187.27,47.7 193.17,47.7 193.24,47.77 | 193.24,47.77 LED453.K | 193.24,47.77 199.13,47.77 | 199.13,47.77 LED469.K | 199.13,47.77 205.03,47.77 | 205.03,47.77 LED485.K | 205.03,47.77 210.94,47.77 | 210.94,47.77 LED501.K | 210.94,47.77 216.84,47.77 | 216.84,47.77 LED517.K | 216.84,47.77 222.63,47.77 | 222.63,47.77 LED533.K | 222.63,47.77 228.63,47.77 | 228.63,47.77 LED549.K | 228.63,47.77 234.44,47.77
  Bottom 0.508: LED565.K 234.44,47.77 | 234.44,47.77 240.24,47.77 | 240.24,47.77 LED581.K | 240.24,47.77 246.13,47.77 | LED597.K 246.13,47.77 | 246.13,47.77 252.03,47.77 | 252.03,47.77 LED613.K | 252.03,47.77 257.94,47.77 LED629.K
N$9
  Bottom 0.254: U$5.1 26.8,46.75 R7.2 26.55,49.3 R96.1
N$10
  Bottom 0.508: U$6.3 34.69,52.7 | 34.69,52.7 LED6.K | LED22.K 39.73,52.7 | 39.73,52.7 34.69,52.7 | LED38.K 45.01,52.7 | 45.01,52.7 39.73,52.7 | LED54.K 50.05,52.7 | 50.05,52.7 45.01,52.7 | LED70.K 55.27,52.7 | 55.27,52.7 50.05,52.7 | LED86.K 60.49,52.7 | 60.49,52.7 55.27,52.7 | LED102.K 65.89,52.7 | 65.89,52.7 60.49,52.7 | LED118.K 71.23,52.7 | 71.23,52.7 65.89,52.7 | LED134.K 76.63,52.7 | 76.63,52.7 71.23,52.7 | LED150.K 81.97,52.7 | 81.97,52.7 76.63,52.7 | LED166.K 87.31,52.7 | 87.31,52.7 81.97,52.7 | LED182.K 92.83,52.7 | 92.83,52.7 87.31,52.7 | LED198.K 98.29,52.7 | 98.29,52.7 92.83,52.7 | LED214.K 103.75,52.7 | 103.75,52.7 98.29,52.7 | LED230.K 109.69,52.7 | 109.69,52.7 103.75,52.7 | LED246.K 115.75,52.7 | 115.75,52.7 109.69,52.7 | LED262.K 121.75,52.7 | 121.75,52.7 115.75,52.7 | LED278.K 127.81,52.7 | 127.81,52.7 121.75,52.7 | LED294.K 133.87,52.7 | 133.87,52.7 127.81,52.7 | LED310.K 139.81,52.7 | 139.81,52.7 133.87,52.7 | LED326.K 145.77,52.7 | 145.77,52.7 139.81,52.7 | LED342.K 151.67,52.7 | 151.67,52.7 145.77,52.7 | LED358.K 157.57,52.7 | 157.57,52.7 151.67,52.7 | LED374.K 163.57,52.7 | 163.57,52.7 157.57,52.7 | LED390.K 169.47,52.7 | 169.47,52.7 163.57,52.7 | LED406.K 175.37,52.7 | 175.37,52.7 169.47,52.7 | 175.37,52.7 181.27,52.7 | LED422.K 181.27,52.7 | 181.27,52.7 187.17,52.7 | 187.17,52.7 LED438.K | 187.17,52.7 193.07,52.7 | 193.07,52.7 LED454.K | 193.07,52.7 198.97,52.7 | 198.97,52.7 LED470.K | 198.97,52.7 204.87,52.7 | 204.87,52.7 LED486.K | 204.87,52.7 210.77,52.7 | LED502.K 210.77,52.7 | 210.77,52.7 216.67,52.7 | 216.67,52.7 LED518.K | 216.67,52.7 222.47,52.7 | 222.47,52.7 LED534.K | 222.47,52.7 228.47,52.7 | LED550.K 228.47,52.7 | 228.47,52.7 234.27,52.7 | 234.27,52.7 LED566.K | 234.27,52.7 240.17,52.7
  Bottom 0.508: 240.17,52.7 LED582.K | 240.17,52.7 245.97,52.7 | LED598.K 245.97,52.7 | 245.97,52.7 251.87,52.7 | LED614.K 251.87,52.7 | 251.87,52.7 257.77,52.7 LED630.K
N$11
  Bottom 0.254: U$6.1 29.45,51.7 R8.2 26.45,51.8 R97.1
N$12
  Bottom 0.508: U$7.3 34.61,57.7 | 34.61,57.7 LED7.K | LED23.K 39.67,57.7 | 39.67,57.7 34.61,57.7 | LED39.K 44.97,57.7 | 44.97,57.7 39.67,57.7 | LED55.K 50.07,57.7 | 50.07,57.7 44.97,57.7 | LED71.K 55.29,57.7 | 55.29,57.7 50.07,57.7 | LED87.K 60.45,57.7 | 60.45,57.7 55.29,57.7 | LED103.K 65.85,57.7 | 65.85,57.7 60.45,57.7 | LED119.K 71.19,57.7 | 71.19,57.7 65.85,57.7 | LED135.K 76.53,57.7 | 76.53,57.7 71.19,57.7 | LED151.K 81.93,57.7 | 81.93,57.7 76.53,57.7 | LED167.K 87.27,57.7 | 87.27,57.7 81.93,57.7 | LED183.K 92.79,57.7 | 92.79,57.7 87.27,57.7 | LED199.K 98.25,57.7 | 98.25,57.7 92.79,57.7 | LED215.K 103.71,57.7 | 103.71,57.7 98.25,57.7 | LED231.K 109.65,57.7 | 109.65,57.7 103.71,57.7 | LED247.K 115.71,57.7 | 115.71,57.7 109.65,57.7 | LED263.K 121.71,57.7 | 121.71,57.7 115.71,57.7 | LED279.K 127.77,57.7 | 127.77,57.7 121.71,57.7 | LED295.K 133.83,57.7 | 133.83,57.7 127.77,57.7 | LED311.K 139.83,57.7 | 139.83,57.7 133.83,57.7 | LED327.K 145.77,57.7 | 145.77,57.7 139.83,57.7 | LED343.K 151.67,57.7 | 151.67,57.7 145.77,57.7 | LED359.K 157.57,57.7 | 157.57,57.7 151.67,57.7 | LED375.K 163.57,57.7 | 163.57,57.7 157.57,57.7 | LED391.K 169.47,57.7 | 169.47,57.7 163.57,57.7 | LED407.K 175.37,57.7 | 175.37,57.7 169.47,57.7 | LED423.K 181.27,57.7 | 181.27,57.7 175.37,57.7 | LED439.K 187.17,57.7 | 187.17,57.7 181.27,57.7 | LED455.K 193.07,57.7 | 193.07,57.7 187.17,57.7 | LED471.K 198.97,57.7 | 198.97,57.7 193.07,57.7 | 198.97,57.7 204.87,57.7 | 204.87,57.7 LED487.K | 204.87,57.7 210.77,57.7 | LED503.K 210.77,57.7 | 210.77,57.7 216.67,57.7 | 216.67,57.7 LED519.K | 216.67,57.7 222.47,57.7 | 222.47,57.7 LED535.K | 222.47,57.7 228.47,57.7 228.49,57.72 | 228.49,57.72 LED551.K | 228.49,57.72 234.28,57.72 | 234.28,57.72 LED567.K
  Bottom 0.508: 234.28,57.72 240.19,57.72 | LED583.K 240.19,57.72 | 240.19,57.72 245.99,57.72 | LED599.K 245.99,57.72 | 245.99,57.72 251.88,57.72 | 251.88,57.72 LED615.K | 251.88,57.72 257.79,57.72 LED631.K
N$13
  Bottom 0.254: U$7.1 29.25,56.9 R9.2 26.55,59.3 R98.1
N$14